# EAGLE design MillBug (EAGLE 6.6.0)
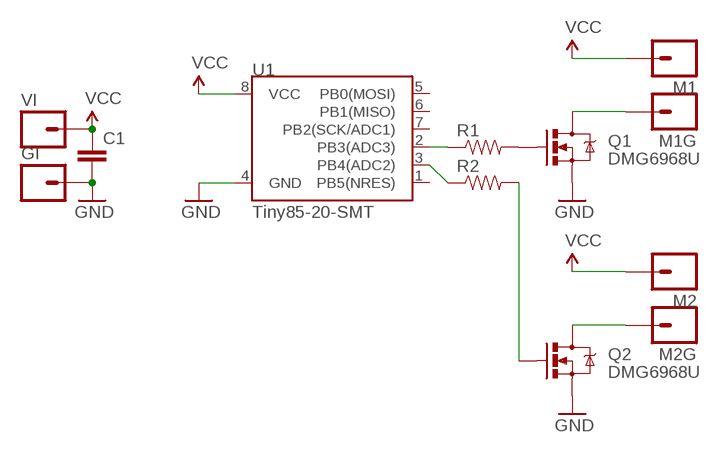
[diagram p0: schematic, sheet 1]

## Parts
C1  CAP0603-CAP  [0603-CAP]
GI  M01PTH  [1X01]
M1  M01PTH  [1X01]
M1G  M01PTH  [1X01]
M2  M01PTH  [1X01]
M2G  M01PTH  [1X01]
Q1  DMG6968U  MOSFET-NCHANNELBSS123LT1G  [SOT23-3]
Q2  DMG6968U  MOSFET-NCHANNELBSS123LT1G  [SOT23-3]
R1  RESISTOR0603-RES  [0603-RES]
R2  RESISTOR0603-RES  [0603-RES]
U1  Tiny85-20-SMT  ATTINY45TINY85-20-SMT  [SO08-EIAJ]
VI  M01PTH  [1X01]

## Nets
GND: C1.2 GI.1 Q1.2(S) Q2.2(S) U1.4(GND)
N$1: R2.1 U1.3(PB4(ADC2))
N$2: R1.1 U1.2(PB3(ADC3))
N$3: M1G.1 Q1.3(D)
N$4: Q1.1(G) R1.2
N$5: Q2.1(G) R2.2
N$8: M2G.1 Q2.3(D)
VCC: C1.1 M1.1 M2.1 U1.8(VCC) VI.1
Unconnected: U1.1(PB5(NRES)) U1.5(PB0(MOSI)) U1.6(PB1(MISO)) U1.7(PB2(SCK/ADC1))

## Library data of the parts
C1 = SparkFun-Capacitors:CAP: Capacitor Standard 0603 ceramic capacitor, and 0.1" leaded capacitor.
GI M1 M1G M2 M2G VI = SparkFun-Connectors:M01: Header 1 Standard 1-pin 0.1" header. Use with straight break away headers (SKU : PRT-00116), right angle break away headers (PRT-00553), swiss pins (PRT-00743), machine pins (PRT-00117), and female headers (PRT-00115).
Q1 Q2 = SparkFun-DiscreteSemi:MOSFET-NCHANNEL: Common NMOSFET Parts MFG P/N Store ID Prod ID FDD8780 TRANS-09984 SI7820DN TRANS-11055 FDS6630A IC-08089 2N7002PW TRANS-11151 FQP30N06L COM-10213 TRANS-10060 BSS123LT1G TRANS-08345 BSS138 TRANS-00830 BS170 2N7000; PROD_ID: TRANS-08345
R1 R2 = SparkFun-Resistors:RESISTOR: Resistor Basic schematic elements and footprints for 0603, 1206, and PTH resistors.
U1 = SparkFun-DigitalIC:ATTINY45: Atmel 8-pin 2/4/8kB flash uC; PROD_ID: IC-09092

## Board
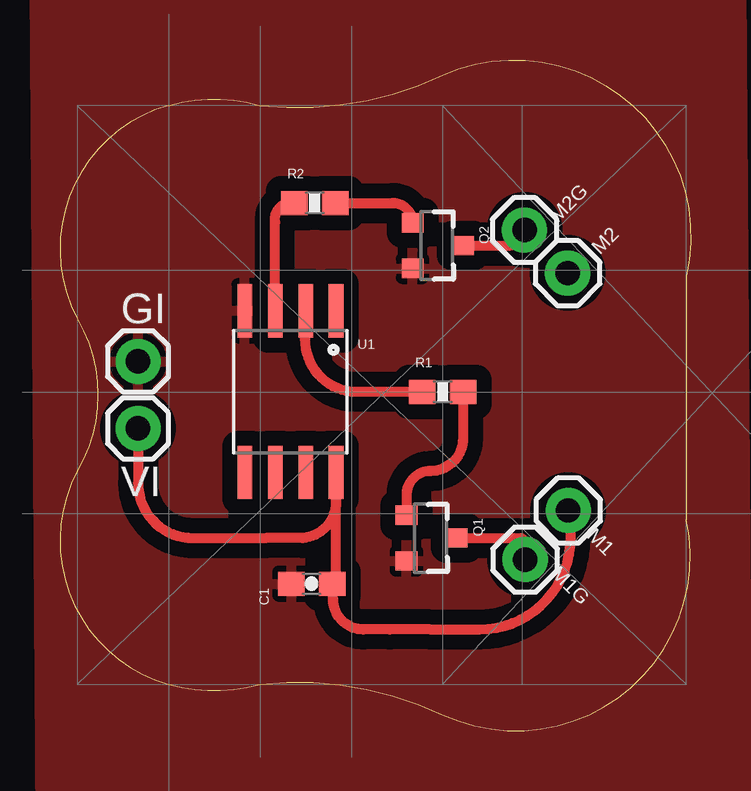
[diagram p1: board, top side]
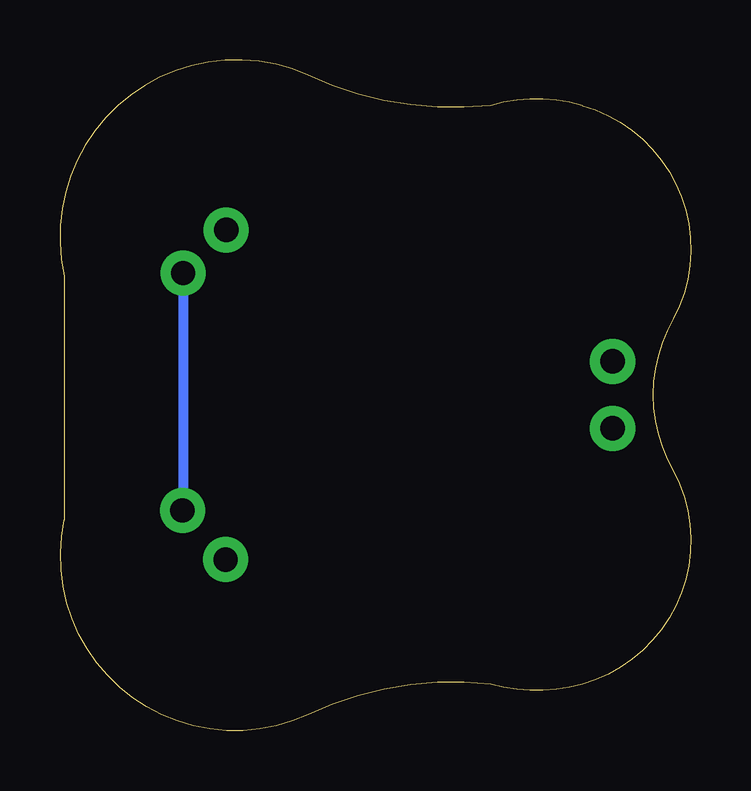
[diagram p2: board, bottom side, seen from below]

Size 26.3 x 27.96 mm. Coordinates in mm from the lower left corner, seen from the top.
Outline: 15.96,27.33 arc-127 26.12,18.95 26.12,8.79 arc-127 15.96,0.66 arc32 8.34,1.93 arc-32 4.53,1.93 arc-102 0.72,10.82 arc61 0.72,17.17 arc-102 4.53,26.06 arc-32 8.34,26.06 arc32 15.96,27.33
Copper layers (1*16): Top 0.035mm / dielectric 1.5mm / Bottom 0.035mm
Design rules "Othermill-DRC-1-64": minimum track width 8mil, minimum drill 0.8mm, track to track 0.39878125mm, track to pad 0.39878125mm, pad to pad 0.39878125mm, via to via 0.39878125mm, smd to smd 0mil, copper to edge 0mil, drill to drill 1mil, minimum pad ring 10mil, minimum via ring 10mil, stop-mask expansion 1mil, vias tented up to drill 30mil, thermal gap 10mil

### Footprints (pad centres in the part's own frame; a part is rotated, then mirrored left to right if it is on the bottom)
0603-CAP = smd 1.1 x 1: 1 -0.85,0; 2 0.85,0
1X01 = drill 1.016 pad 1.88: 1 0,0
SOT23-3 = smd 0.8 x 0.9: 1 -0.95,-1; 2 0.95,-1; 3 0,1.1
0603-RES = smd 1.1 x 1: 1 -0.85,0; 2 0.85,0
SO08-EIAJ = smd 0.61 x 2.21: 1 -1.905,-3.378; 2 -0.635,-3.378; 3 0.635,-3.378; 4 1.905,-3.378; 5 1.905,3.353; 6 0.635,3.353; 7 -0.635,3.353; 8 -1.905,3.353

### Placement (x,y rotation side)
C1  10.5,6.12 180 top
GI  3.26,15.39 0 top
M1  21.19,9.18 135 top
M1G  19.4,7.13 135 top
M2  21.16,19.08 225 top
M2G  19.37,20.87 225 top
Q1  15.45,8.03 270 top
Q2  15.7,20.22 270 top
R1  15.96,14.12 0 top
R2  10.62,22 0 top
U1  9.61,14.12 180 top
VI  3.26,12.6 0 top

### Tracks (layer width: path | path; a pad name or v marks a point on that pad's centre or on a via)
GND
  Top 0.406: 7.7,17.17 U1.4
  pour Top (isolate 0.635): 28.4,31.14 28.66,-3.91 -0.81,-3.91 -1.06,31.14
N$1
  Top 0.406: U1.3 8.97,21.2 8.97,21.45 arc-90 R2.1
N$2
  Top 0.406: U1.2 10.24,16.54 arc90 12.15,14.12 R1.1
N$3
  Top 0.406: Q1.3 19.26,8.03 arc-90 M1G.1
N$4
  Top 0.406: Q1.1 14.45,9.82 arc-90 15.45,10.82 arc90 16.81,12.18 R1.2
N$5
  Top 0.406: R2.2 13.88,22 arc-90 Q2.1
N$8
  Top 0.406: Q2.3 18.72,20.22 arc90 M2G.1
VCC
  Top 0.406: 11.51,10.57 U1.8 11.51,10.57 | 21.16,9.71 arc90 M1.1 | M1.1 arc-90 21.29,9.08 21.29,8.03 arc-90 17.48,4.22 15.45,4.22 13.76,4.22 12.66,4.22 arc-90 11.39,5.49 11.39,6.08 arc90 C1.1 11.51,6.12 11.51,9.68 | 21.16,9.71 arc90 M1.1 | 21.16,9.71 arc90 M1.1 | VI.1 3.26,13.11 3.26,10.31 arc90 5.54,8.03 8.08,8.03 8.59,8.03 10.12,8.03 arc90 11.51,9.68 | 11.51,9.68 11.51,10.31 | 11.51,10.31 11.51,10.57 | 11.51,9.68 11.51,10.31 | 21.16,9.71 M1.1
  Bottom 0.406: M2.1 21.16,9.71 M1.1